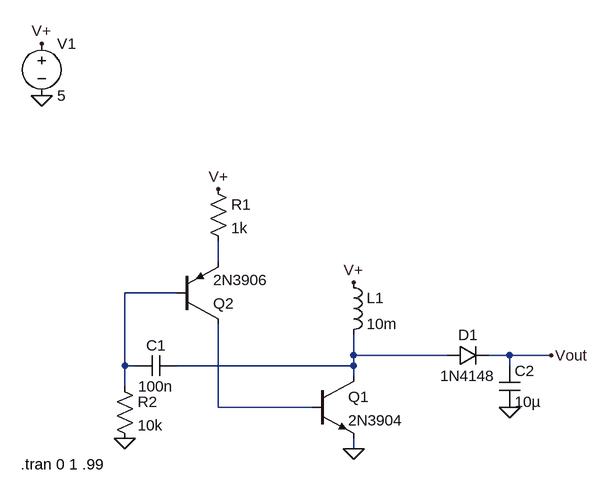
[diagram p0: schematic 09H-17.asc]
09H-17.asc, the LTspice schematic file:
Version 4.1
SHEET 1 880 680
WIRE 96 0 96 -32
WIRE 32 48 -48 48
WIRE 304 144 304 112
WIRE 448 144 304 144
WIRE 544 144 512 144
WIRE 608 144 544 144
WIRE -48 160 -48 48
WIRE -32 160 -48 160
WIRE 304 160 304 144
WIRE 304 160 32 160
WIRE 544 160 544 144
WIRE 304 176 304 160
WIRE -48 192 -48 160
WIRE 96 224 96 96
WIRE 240 224 96 224
WIRE 304 288 304 272
FLAG 304 288 0
FLAG -48 272 0
FLAG 544 224 0
FLAG 608 144 Vout
FLAG 304 32 V+
FLAG 96 -112 V+
FLAG -176 -256 0
FLAG -176 -336 V+
SYMBOL npn 240 176 R0
SYMATTR InstName Q1
SYMATTR Value 2N3904
SYMBOL pnp 32 96 M180
SYMATTR InstName Q2
SYMATTR Value 2N3906
SYMBOL res 80 -128 R0
SYMATTR InstName R1
SYMATTR Value 1k
SYMBOL res -64 176 R0
SYMATTR InstName R2
SYMATTR Value 10k
SYMBOL cap 32 144 R90
WINDOW 0 0 32 VBottom 2
WINDOW 3 32 32 VTop 2
SYMATTR InstName C1
SYMATTR Value 100n
SYMBOL ind 288 16 R0
SYMATTR InstName L1
SYMATTR Value 10m
SYMBOL diode 448 160 R270
WINDOW 0 32 32 VTop 2
WINDOW 3 0 32 VBottom 2
SYMATTR InstName D1
SYMATTR Value 1N4148
SYMBOL cap 528 160 R0
SYMATTR InstName C2
SYMATTR Value 10µ
SYMBOL voltage -176 -352 R0
WINDOW 123 0 0 Left 0
WINDOW 39 0 0 Left 0
SYMATTR InstName V1
SYMATTR Value 5
TEXT -208 312 Left 2 !.tran 0 1 .99

The netlist it stands for:
* 09H-17.asc
Q1 N003 N004 0 0 2N3904
Q2 N004 N002 N001 0 2N3906
R1 V+ N001 1k
R2 N002 0 10k
C1 N003 N002 100n
L1 V+ N003 10m
D1 N003 Vout 1N4148
C2 Vout 0 10µ
V1 V+ 0 5
.model D D
.lib standard.dio
.model NPN NPN
.model PNP PNP
.lib standard.bjt
.tran 0 1 .99
.backanno
.end